# Altium schematic sheet SCH-EC_Port.SchDoc
size A4
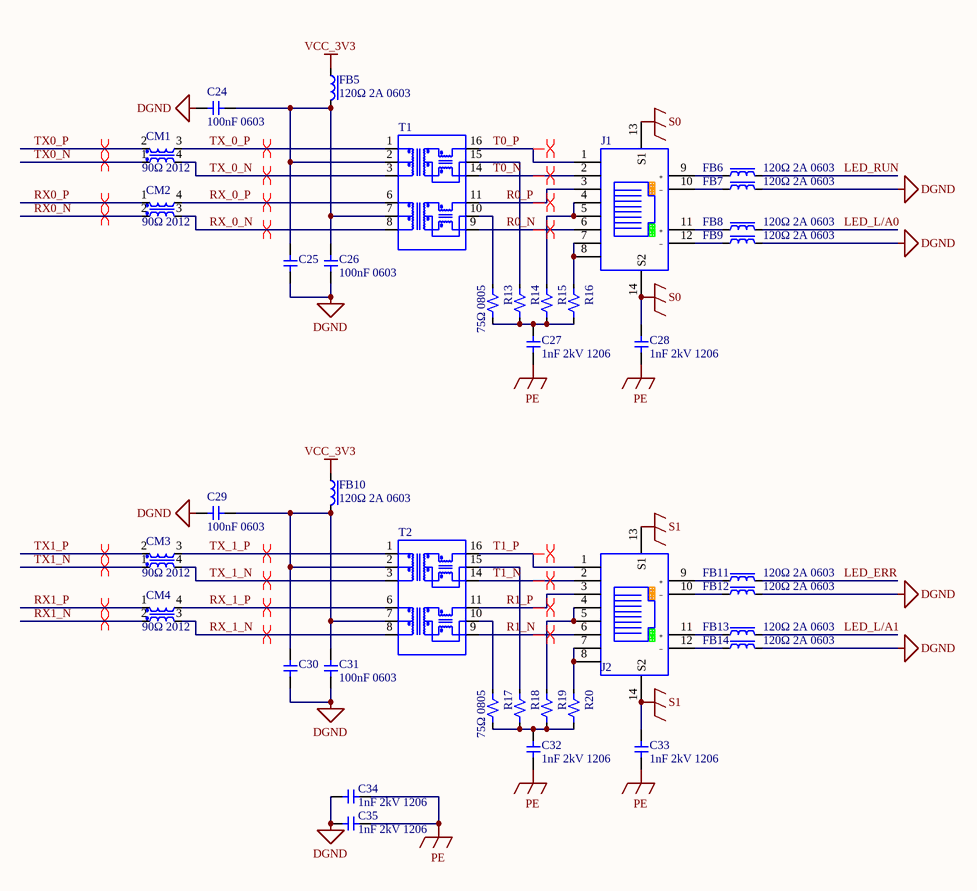
[diagram p0: SCH-EC_Port.SchDoc]

## Parts
C24  100nF 0603  [CAPC1608X08 (0603)]
C25  100nF 0603  [CAPC1608X08 (0603)]  (value not drawn)
C26  100nF 0603  [CAPC1608X08 (0603)]
C27  1nF 2kV 1206  [CAPC3216X16 (1206)]
C28  1nF 2kV 1206  [CAPC3216X16 (1206)]
C29  100nF 0603  [CAPC1608X08 (0603)]
C30  100nF 0603  [CAPC1608X08 (0603)]  (value not drawn)
C31  100nF 0603  [CAPC1608X08 (0603)]
C32  1nF 2kV 1206  [CAPC3216X16 (1206)]
C33  1nF 2kV 1206  [CAPC3216X16 (1206)]
C34  1nF 2kV 1206  [CAPC3216X16 (1206)]
C35  1nF 2kV 1206  [CAPC3216X16 (1206)]
CM1  90Ω 2012  [CAF-80P120X200-4N]
CM2  90Ω 2012  [CAF-80P120X200-4N]
CM3  90Ω 2012  [CAF-80P120X200-4N]
CM4  90Ω 2012  [CAF-80P120X200-4N]
FB5  120Ω 2A 0603  [INDC1608X08 (0603)]
FB6  120Ω 2A 0603  [INDC1608X08 (0603)]
FB7  120Ω 2A 0603  [INDC1608X08 (0603)]
FB8  120Ω 2A 0603  [INDC1608X08 (0603)]
FB9  120Ω 2A 0603  [INDC1608X08 (0603)]
FB10  120Ω 2A 0603  [INDC1608X08 (0603)]
FB11  120Ω 2A 0603  [INDC1608X08 (0603)]
FB12  120Ω 2A 0603  [INDC1608X08 (0603)]
FB13  120Ω 2A 0603  [INDC1608X08 (0603)]
FB14  120Ω 2A 0603  [INDC1608X08 (0603)]
J1  1901-396X  [1901-396X]  (value not drawn)
J2  1901-396X  [1901-396X]  (value not drawn)
R13  75Ω 0805  [RESC2012X05 (0805)]
R14  75Ω 0805  [RESC2012X05 (0805)]  (value not drawn)
R15  75Ω 0805  [RESC2012X05 (0805)]  (value not drawn)
R16  75Ω 0805  [RESC2012X05 (0805)]  (value not drawn)
R17  75Ω 0805  [RESC2012X05 (0805)]
R18  75Ω 0805  [RESC2012X05 (0805)]  (value not drawn)
R19  75Ω 0805  [RESC2012X05 (0805)]  (value not drawn)
R20  75Ω 0805  [RESC2012X05 (0805)]  (value not drawn)
T1  H1601CE  [SOIC127P940X640-16N]  (value not drawn)
T2  H1601CE  [SOIC127P940X640-16N]  (value not drawn)

## Nets
DGND: C24.2 C25.2 C26.2 C29.2 C30.2 C31.2 C34.1 C35.1 FB7.2 FB9.2 FB12.2 FB14.2
PE: C27.2 C28.2 C32.2 C33.2 C34.2 C35.2
S0: C28.1 J1.13(S1) J1.14(S2)
S1: C33.1 J2.13(S1) J2.14(S2)
VCC_3V3: FB5.1 FB10.1
LED_ERR: FB11.2
LED_L/A0: FB8.2
LED_L/A1: FB13.2
LED_RUN: FB6.2
R0_N: J1.6(Rx-) T1.9
R0_P: J1.3(Rx+) T1.11
R1_N: J2.6(Rx-) T2.9
R1_P: J2.3(Rx+) T2.11
RX0_N: CM2.2
RX0_P: CM2.1
RX1_N: CM4.2
RX1_P: CM4.1
RX_0_N: CM2.3 T1.8
RX_0_P: CM2.4 T1.6
RX_1_N: CM4.3 T2.8
RX_1_P: CM4.4 T2.6
T0_N: J1.2(Tx-) T1.14
T0_P: J1.1(Tx+) T1.16
T1_N: J2.2(Tx-) T2.14
T1_P: J2.1(Tx+) T2.16
TX0_N: CM1.1
TX0_P: CM1.2
TX1_N: CM3.1
TX1_P: CM3.2
TX_0_N: CM1.4 T1.3
TX_0_P: CM1.3 T1.1
TX_1_N: CM3.4 T2.3
TX_1_P: CM3.3 T2.1
NetC24_1: C24.1 C25.1 C26.1 FB5.2 T1.2 T1.7
NetC27_1: C27.1 R13.1 R14.1 R15.1 R16.1
NetC29_1: C29.1 C30.1 C31.1 FB10.2 T2.2 T2.7
NetC32_1: C32.1 R17.1 R18.1 R19.1 R20.1
NetFB6_1: FB6.1 J1.9(﹢)
NetFB7_1: FB7.1 J1.10(﹣)
NetFB8_1: FB8.1 J1.11(﹢)
NetFB9_1: FB9.1 J1.12(﹣)
NetFB11_1: FB11.1 J2.9(﹢)
NetFB12_1: FB12.1 J2.10(﹣)
NetFB13_1: FB13.1 J2.11(﹢)
NetFB14_1: FB14.1 J2.12(﹣)
NetJ1_4: J1.4 J1.5 R15.2
NetJ1_7: J1.7 J1.8 R16.2
NetJ2_4: J2.4 J2.5 R19.2
NetJ2_7: J2.7 J2.8 R20.2
NetR13_2: R13.2 T1.10
NetR14_2: R14.2 T1.15
NetR17_2: R17.2 T2.10
NetR18_2: R18.2 T2.15

## Layout directives
differential pair: R0_N, R0_P, R1_N, R1_P, RX0_N, RX0_P, RX1_N, RX1_P, RX_0_N, RX_0_P, RX_1_N, RX_1_P, T0_N, T0_P, T1_N, T1_P, TX0_N, TX0_P, TX1_N, TX1_P, TX_0_N, TX_0_P, TX_1_N, TX_1_P

## Library data of the parts
C24-C26 C29-C31 = 100nF 0603: 贴片MLCC电容 100nF 50V X7R 10% 0603; 1st Manufacturer: Yageo; 1st PartNumber: CC0603KRX7R9BB104; 2nd Manufacturer: TDK; 2nd PartNumber: CGA3E2X7R1H104K080AA; ERP_ID: 12A20039
C27 C28 C32-C35 = 1nF 2kV 1206: 贴片MLCC电容 1.0nF 2KV X7R 10% 1206; 1st Manufacturer: Yageo; 1st PartNumber: CC1206KKX7RDBB102; ERP_ID: 12A20057
CM1-CM4 = 90Ω@100MHz 2012: 高速信号共模滤波器 90Ω@100MHz, 0.33A, 2012; 1st PartNumber: SDCW2012-2-900TF; 1st Manufacturer: 顺络; 2nd Manufacturer: TDK; 2nd PartNumber: ACM2012E-900-2P-T01; ERP_ID: 12A40029
FB5-FB14 = 120Ω@100MHz 2A 0603: 电源线磁珠 0603 120Ω@100MHz 2A; 1st PartNumber: PZ1608U121-2R0TF; 1st Manufacturer: 顺络; 2nd Manufacturer: Murata; 2nd PartNumber: BLM18PG121SN1D; ERP_ID: 12A40009
J1 J2 = 1901-396X: 以太网连接器 90度弯 带灯（左黄右绿）金属外壳 EMI弹片; 1st Manufacturer: KINSUN; ERP_ID: 15C80007; 1st PartNumber: 1901-396X; 2nd Manufacturer: -; 2nd PartNumber: -
R13-R20 = 75Ω 0805: 贴片厚膜电阻 75Ω 1% 0805; 1st Manufacturer: Yageo; 1st PartNumber: RC0805FR-0775RL; 2nd Manufacturer: Bourns; 2nd PartNumber: CR0805-FX-75R0ELF; ERP_ID: 12A10083
T1 T2 = H1601CE: 单口百兆网络隔离变压器; 1st Manufacturer: MNC; 2nd Manufacturer: Pulse; 2nd PartNumber: H1102NL; ERP_ID: 12B20002; 1st PartNumber: H1601CE